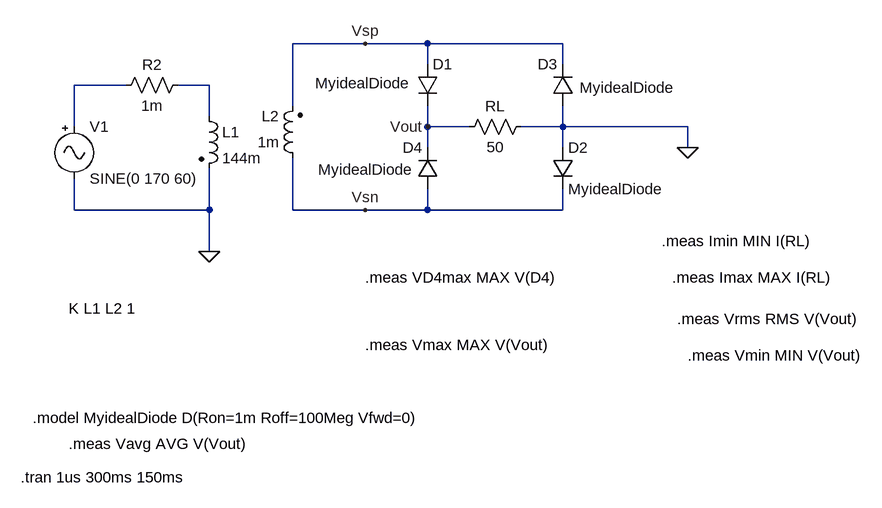
[diagram p0: schematic Lab 5 - Part 4.asc]
Lab 5 - Part 4.asc, the LTspice schematic file:
Version 4
SHEET 1 1232 700
WIRE 448 16 336 16
WIRE 544 16 448 16
WIRE 752 16 544 16
WIRE 544 48 544 16
WIRE 752 48 752 16
WIRE 80 80 0 80
WIRE 208 80 160 80
WIRE 336 112 336 16
WIRE 208 128 208 80
WIRE 0 144 0 80
WIRE 544 144 544 112
WIRE 608 144 544 144
WIRE 752 144 752 112
WIRE 752 144 688 144
WIRE 944 144 752 144
WIRE 544 176 544 144
WIRE 752 176 752 144
WIRE 944 176 944 144
WIRE 0 272 0 224
WIRE 208 272 208 208
WIRE 208 272 0 272
WIRE 336 272 336 192
WIRE 448 272 336 272
WIRE 544 272 544 240
WIRE 544 272 448 272
WIRE 752 272 752 240
WIRE 752 272 544 272
WIRE 208 336 208 272
FLAG 208 336 0
FLAG 544 144 Vout
FLAG 944 176 0
FLAG 448 272 Vsn
FLAG 448 16 Vsp
SYMBOL res 176 64 R90
WINDOW 0 0 56 VBottom 2
WINDOW 3 32 56 VTop 2
SYMATTR InstName R2
SYMATTR Value 1m
SYMBOL ind2 192 112 R0
SYMATTR InstName L1
SYMATTR Value 144m
SYMBOL ind2 352 208 R180
WINDOW 0 36 80 Left 2
WINDOW 3 36 40 Left 2
SYMATTR InstName L2
SYMATTR Value 1m
SYMBOL Misc\\signal 0 128 R0
WINDOW 123 0 0 Left 0
WINDOW 39 0 0 Left 0
SYMATTR InstName V1
SYMATTR Value SINE(0 170 60)
SYMBOL diode 528 48 R0
WINDOW 3 -157 29 Left 2
SYMATTR InstName D1
SYMATTR Value MyidealDiode
SYMBOL diode 736 176 R0
SYMATTR InstName D2
SYMATTR Value MyidealDiode
SYMBOL diode 768 112 R180
WINDOW 0 24 64 Left 2
WINDOW 3 -156 28 Left 2
SYMATTR InstName D3
SYMATTR Value MyidealDiode
SYMBOL diode 560 240 R180
WINDOW 0 24 64 Left 2
WINDOW 3 38 30 Left 2
SYMATTR InstName D4
SYMATTR Value MyidealDiode
SYMBOL res 704 128 R90
WINDOW 0 0 56 VBottom 2
WINDOW 3 32 56 VTop 2
SYMATTR InstName RL
SYMATTR Value 50
TEXT -8 632 Left 2 !.meas Vavg AVG V(Vout)
TEXT -82 684 Left 2 !.tran 1us 300ms 150ms
TEXT -64 592 Left 2 !.model MyidealDiode D(Ron=1m Roff=100Meg Vfwd=0)
TEXT -8 424 Left 2 !K L1 L2 1
TEXT 448 480 Left 2 !.meas Vmax MAX V(Vout)
TEXT 928 440 Left 2 !.meas Vrms RMS V(Vout)
TEXT 944 496 Left 2 !.meas Vmin MIN V(Vout)
TEXT 920 376 Left 2 !.meas Imax MAX I(RL)
TEXT 904 320 Left 2 !.meas Imin MIN I(RL)
TEXT 448 376 Left 2 !.meas VD4max MAX V(D4)

The netlist it stands for:
* Lab 5 - Part 4.asc
R2 N002 N001 1m
L1 N002 0 144m
L2 Vsn Vsp 1m
V1 N001 0 SINE(0 170 60)
D1 Vsp Vout MyidealDiode
D2 0 Vsn MyidealDiode
D3 0 Vsp MyidealDiode
D4 Vsn Vout MyidealDiode
RL 0 Vout 50
.model D D
.lib standard.dio
.meas Vavg AVG V(Vout)
.tran 1us 300ms 150ms
.model MyidealDiode D(Ron=1m Roff=100Meg Vfwd=0)
K L1 L2 1
.meas Vmax MAX V(Vout)
.meas Vrms RMS V(Vout)
.meas Vmin MIN V(Vout)
.meas Imax MAX I(RL)
.meas Imin MIN I(RL)
.meas VD4max MAX V(D4)
.backanno
.end

* Results of the author's LTspice run, read from the files saved beside the schematic
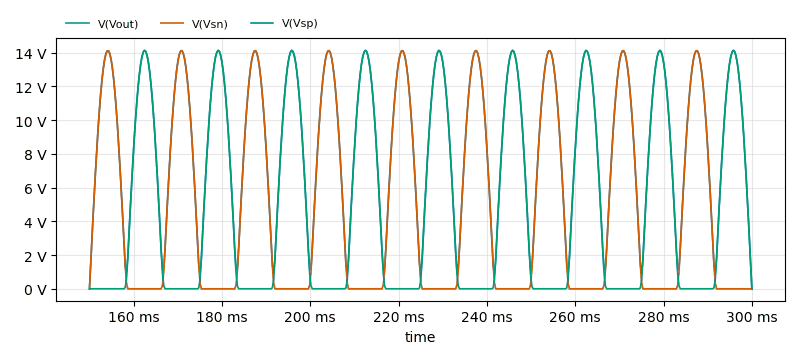
[diagram p1: Transient Analysis of Lab 5 - Part 4.asc, plotted from the saved traces]
* Transient Analysis, 1 run:
*   V(Vout): min 0 V, max 14.13 V, average 9.017 V, rms 9.989 V, last 0 V
*   V(Vsn): min -282.6 µV, max 14.11 V, average 4.508 V, rms 7.062 V, last 0 V
*   V(Vsp): min -282.2 µV, max 14.13 V, average 4.509 V, rms 7.063 V, last 0 V
* From the log:
*   vavg: AVG(v(vout))=9.01729 FROM 0 TO 0.15
*   vmax: MAX(v(vout))=14.1288 FROM 0 TO 0.15
*   vrms: RMS(v(vout))=9.97989 FROM 0 TO 0.15
*   vmin: MIN(v(vout))=-3.04201e-07 FROM 0 TO 0.15
*   imax: MAX(i(rl))=6.08401e-09 FROM 0 TO 0.15
*   imin: MIN(i(rl))=-0.282576 FROM 0 TO 0.15
*   Measurement "vd4max" FAIL'ed